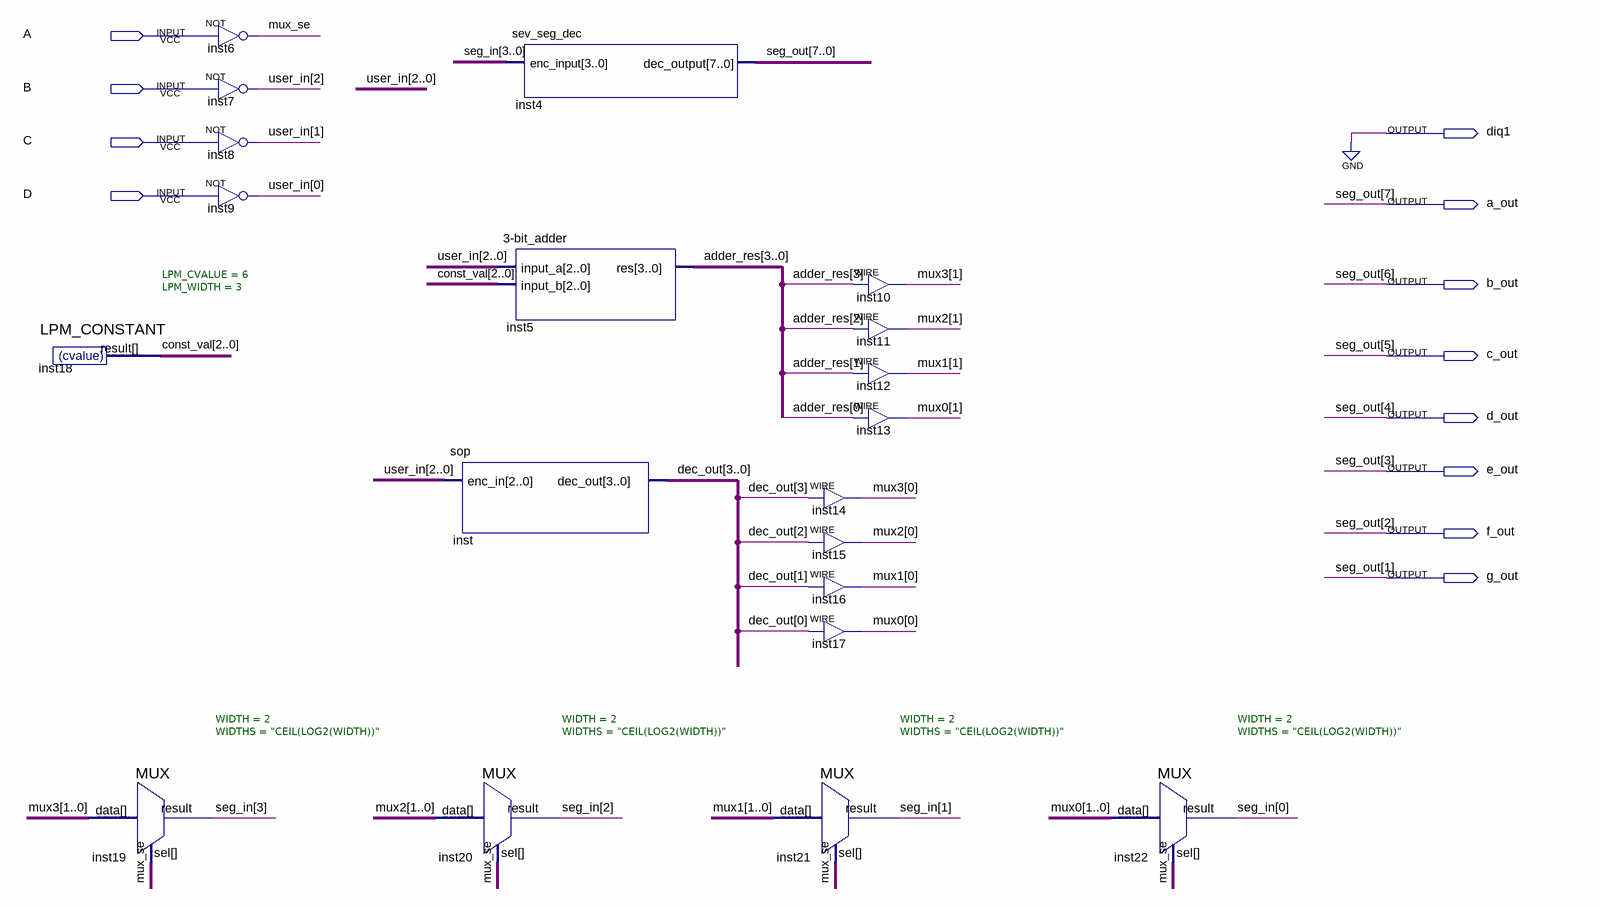
[diagram p0: schematic sheet]
// Quartus schematic practice_2.bdf as structural Verilog: 20 symbols, 12 pins
module practice_2 (
  input  A,
  input  B,
  input  C,
  input  D,
  output diq1,
  output a_out,
  output b_out,
  output c_out,
  output d_out,
  output e_out,
  output f_out,
  output g_out
);

  wire mux_se;
  wire [0:0] seg_out;
  wire [1:0] mux0, mux1, mux2, mux3;
  wire [2:0] const_val, user_in;
  wire [3:0] adder_res, dec_out, seg_in;

  LPM_CONSTANT #(.LPM_CVALUE(6), .LPM_WIDTH(3)) inst18 (.result(const_val));
  MUX #(.WIDTH(2), .WIDTHS("CEIL(LOG2(WIDTH))")) inst19 (.data(mux3), .sel(mux_se), .result(seg_in[3]));
  not inst6 (mux_se, A);
  not inst7 (user_in[2], B);
  not inst8 (user_in[1], C);
  not inst9 (user_in[0], D);
  sop inst (.enc_in(user_in), .dec_out(dec_out));
  MUX #(.WIDTH(2), .WIDTHS("CEIL(LOG2(WIDTH))")) inst20 (.data(mux2), .sel(mux_se), .result(seg_in[2]));
  sev_seg_dec inst4 (.enc_input(seg_in), .dec_output({a_out, b_out, c_out, d_out, e_out, f_out, g_out, seg_out[0]}));
  \3-bit_adder  inst5 (.input_a(user_in), .input_b(const_val), .res(adder_res));
  MUX #(.WIDTH(2), .WIDTHS("CEIL(LOG2(WIDTH))")) inst21 (.data(mux1), .sel(mux_se), .result(seg_in[1]));
  assign mux3[1] = adder_res[3];  // WIRE inst10
  assign mux2[1] = adder_res[2];  // WIRE inst11
  assign mux1[1] = adder_res[1];  // WIRE inst12
  assign mux0[1] = adder_res[0];  // WIRE inst13
  assign mux3[0] = dec_out[3];  // WIRE inst14
  assign mux2[0] = dec_out[2];  // WIRE inst15
  assign mux1[0] = dec_out[1];  // WIRE inst16
  assign mux0[0] = dec_out[0];  // WIRE inst17
  MUX #(.WIDTH(2), .WIDTHS("CEIL(LOG2(WIDTH))")) inst22 (.data(mux0), .sel(mux_se), .result(seg_in[0]));

  assign diq1 = 1'b0;

  // Other names for the same wires on the sheet: seg_out[7:1] = {a_out, b_out, c_out, d_out, e_out, f_out, g_out}
endmodule
